# EAGLE schematic display_board (EAGLE 8.4.0)
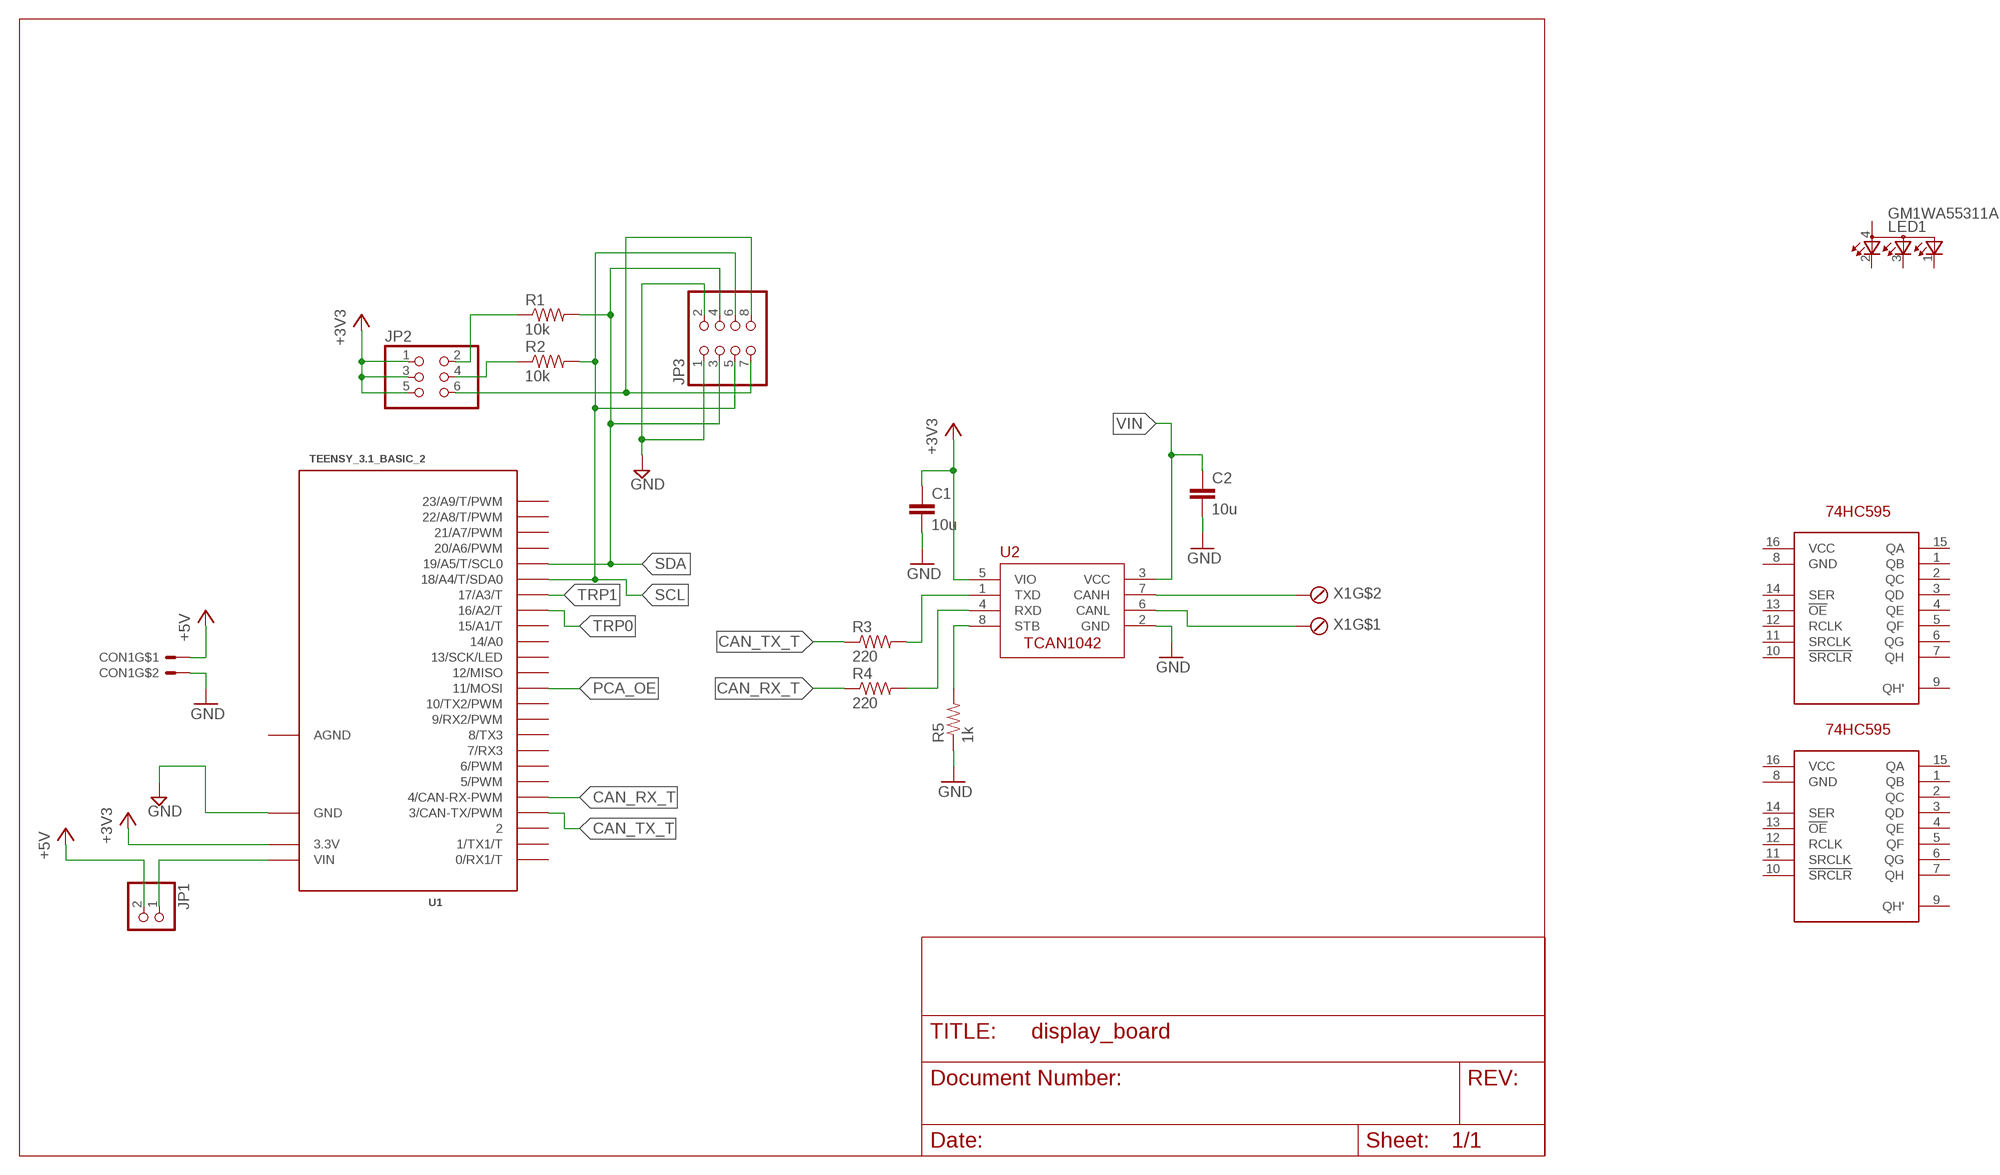
[diagram p0: schematic, sheet 1, part 1 of 2]
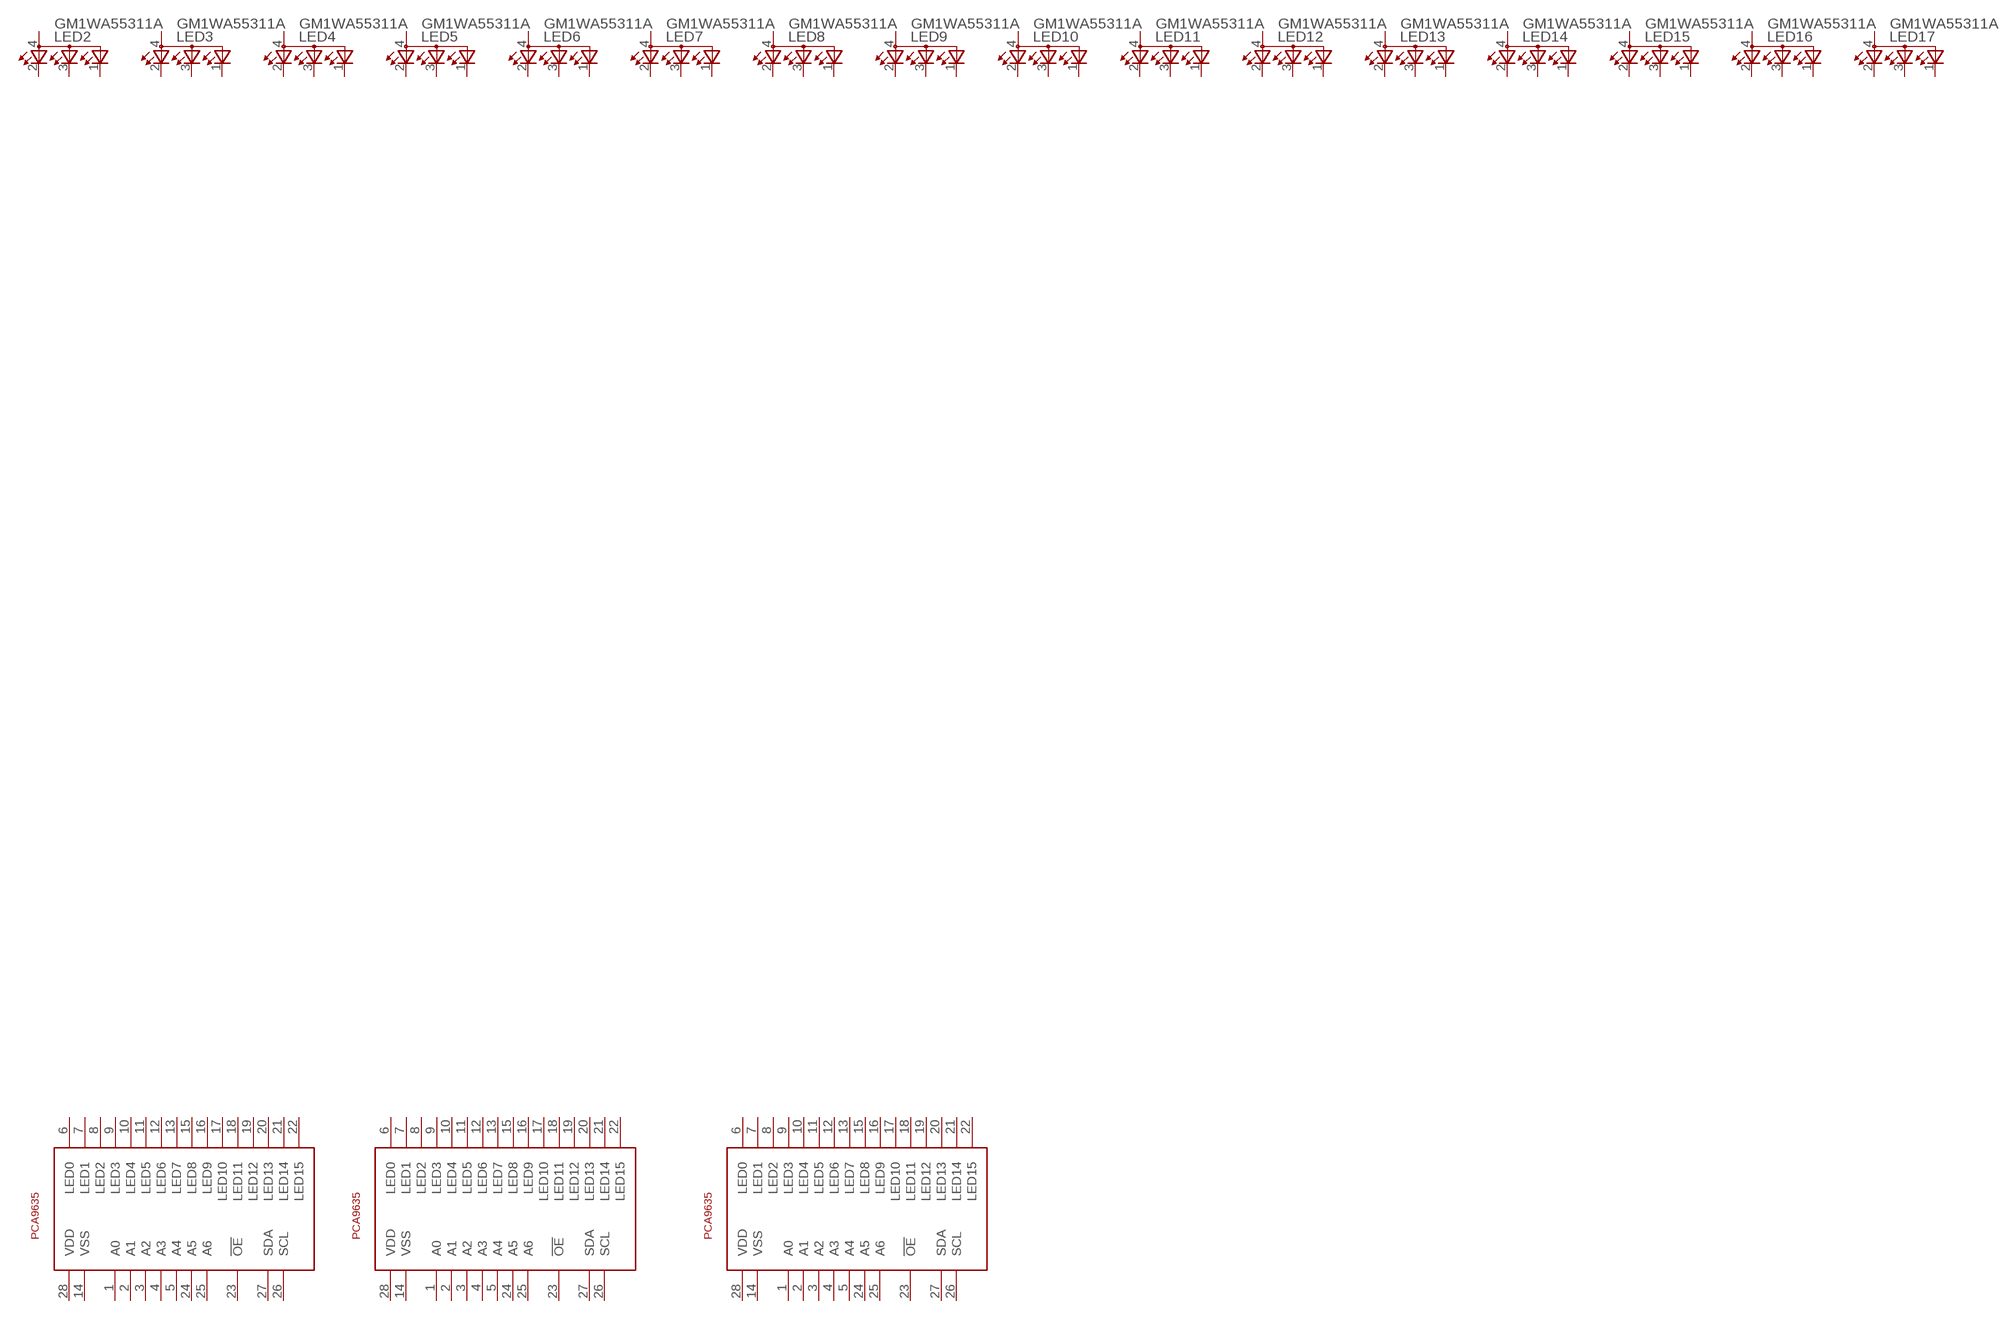
[diagram p1: schematic, sheet 1, part 2 of 2]

## Parts
C1  10u  C-EUC0805  [C0805]
C2  10u  C-EUC0805  [C0805]
CON1  MOLEX_5566-2  [5566-2]
JP1  PINHD-1X2  [1X02]
JP2  PINHD-2X3  [2X03]
JP3  PINHD-2X4  [2X04]
LED1  GM1WA55311A  [GM1WA55311A]
LED2  GM1WA55311A  [GM1WA55311A]
LED3  GM1WA55311A  [GM1WA55311A]
LED4  GM1WA55311A  [GM1WA55311A]
LED5  GM1WA55311A  [GM1WA55311A]
LED6  GM1WA55311A  [GM1WA55311A]
LED7  GM1WA55311A  [GM1WA55311A]
LED8  GM1WA55311A  [GM1WA55311A]
LED9  GM1WA55311A  [GM1WA55311A]
LED10  GM1WA55311A  [GM1WA55311A]
LED11  GM1WA55311A  [GM1WA55311A]
LED12  GM1WA55311A  [GM1WA55311A]
LED13  GM1WA55311A  [GM1WA55311A]
LED14  GM1WA55311A  [GM1WA55311A]
LED15  GM1WA55311A  [GM1WA55311A]
LED16  GM1WA55311A  [GM1WA55311A]
LED17  GM1WA55311A  [GM1WA55311A]
R1  10k  R-US_R1206  [R1206]
R2  10k  R-US_R1206  [R1206]
R3  220  R-US_R0805  [R0805]
R4  220  R-US_R0805  [R0805]
R5  1k  R-US_R0805  [R0805]
U1  TEENSY_3.1_BASIC_2  [TEENSY_3.1_BASIC_2]
U2  TCAN1042HVDR  [SOIC8]
U$1  PCA9635  [TSSOP28]
U$2  PCA9635  [TSSOP28]
U$3  PCA9635  [TSSOP28]
U$4  SN74HC595D  [SOIC16]
U$5  SN74HC595D  [SOIC16]
X1  OSTVN02A150  [OSTVN02A150]

## Nets
+3V3: C1.1 JP2.1 JP2.3 JP2.5 U1.3.3V U2.5(VIO)
+5V: CON1.1 JP1.2
CAN_RX: R4.2 U2.4(RXD)
CAN_RX_T: R4.1 U1.4(4/CAN-RX-PWM)
CAN_TX: R3.2 U2.1(TXD)
CAN_TX_T: R3.1 U1.3(3/CAN-TX/PWM)
CANH: U2.7(CANH) X1.P$2
CANL: U2.6(CANL) X1.P$1
GND [net1]: C1.2 C2.2 CON1.2 JP3.1 JP3.2 R5.1 U1.GND U2.2(GND)
I2_3V3: JP2.6 JP3.7 JP3.8
PCA_OE: U1.11(11/MOSI)
SCL: JP3.5 JP3.6 R2.2 U1.18/A4(18/A4/T/SDA0)
SCL_3V3: JP2.2 R1.1
SDA: JP3.3 JP3.4 R1.2 U1.19/A5(19/A5/T/SCL0)
SDA_3V3: JP2.4 R2.1
STB: R5.2 U2.8(STB)
TRP0: U1.16/A2(16/A2/T)
TRP1: U1.17/A3(17/A3/T)
VIN: C2.1 JP1.1 U1.VIN U2.3(VCC)
Unconnected: LED1.1(CGREEN) LED1.2(CRED) LED1.3(CBLUE) LED1.4(A) LED2.1(CGREEN) LED2.2(CRED) LED2.3(CBLUE) LED2.4(A) LED3.1(CGREEN) LED3.2(CRED) LED3.3(CBLUE) LED3.4(A) LED4.1(CGREEN) LED4.2(CRED) LED4.3(CBLUE) LED4.4(A) LED5.1(CGREEN) LED5.2(CRED) LED5.3(CBLUE) LED5.4(A) LED6.1(CGREEN) LED6.2(CRED) LED6.3(CBLUE) LED6.4(A) LED7.1(CGREEN) LED7.2(CRED) LED7.3(CBLUE) LED7.4(A) LED8.1(CGREEN) LED8.2(CRED) LED8.3(CBLUE) LED8.4(A) LED9.1(CGREEN) LED9.2(CRED) LED9.3(CBLUE) LED9.4(A) LED10.1(CGREEN) LED10.2(CRED) LED10.3(CBLUE) LED10.4(A) LED11.1(CGREEN) LED11.2(CRED) LED11.3(CBLUE) LED11.4(A) LED12.1(CGREEN) LED12.2(CRED) LED12.3(CBLUE) LED12.4(A) LED13.1(CGREEN) LED13.2(CRED) LED13.3(CBLUE) LED13.4(A) LED14.1(CGREEN) LED14.2(CRED) LED14.3(CBLUE) LED14.4(A) LED15.1(CGREEN) LED15.2(CRED) LED15.3(CBLUE) LED15.4(A) LED16.1(CGREEN) LED16.2(CRED) LED16.3(CBLUE) LED16.4(A) LED17.1(CGREEN) LED17.2(CRED) LED17.3(CBLUE) LED17.4(A) U1.0(0/RX1/T) U1.1(1/TX1/T) U1.2 U1.5(5/PWM) U1.6(6/PWM) U1.7(7/RX3) U1.8(8/TX3) U1.9(9/RX2/PWM) U1.10(10/TX2/PWM) U1.12(12/MISO) U1.13(13/SCK/LED) U1.14/A0 U1.15/A1(15/A1/T) U1.20/A6(20/A6/PWM) U1.21/A7(21/A7/PWM) U1.22/A8(22/A8/T/PWM) U1.23/A9(23/A9/T/PWM) U$1.1(A0) U$1.2(A1) U$1.3(A2) U$1.4(A3) U$1.5(A4) U$1.6(LED0) U$1.7(LED1) U$1.8(LED2) U$1.9(LED3) U$1.10(LED4) U$1.11(LED5) U$1.12(LED6) U$1.13(LED7) U$1.15(LED8) U$1.16(LED9) U$1.17(LED10) U$1.18(LED11) U$1.19(LED12) U$1.20(LED13) U$1.21(LED14) U$1.22(LED15) U$1.23(!OE) U$1.24(A5) U$1.25(A6) U$1.26(SCL) U$1.27(SDA) U$2.1(A0) U$2.2(A1) U$2.3(A2) U$2.4(A3) U$2.5(A4) U$2.6(LED0) U$2.7(LED1) U$2.8(LED2) U$2.9(LED3) U$2.10(LED4) U$2.11(LED5) U$2.12(LED6) U$2.13(LED7) U$2.15(LED8) U$2.16(LED9) U$2.17(LED10) U$2.18(LED11) U$2.19(LED12) U$2.20(LED13) U$2.21(LED14) U$2.22(LED15) U$2.23(!OE) U$2.24(A5) U$2.25(A6) U$2.26(SCL) U$2.27(SDA) U$3.1(A0) U$3.2(A1) U$3.3(A2) U$3.4(A3) U$3.5(A4) U$3.6(LED0) U$3.7(LED1) U$3.8(LED2) U$3.9(LED3) U$3.10(LED4) U$3.11(LED5) U$3.12(LED6) U$3.13(LED7) U$3.15(LED8) U$3.16(LED9) U$3.17(LED10) U$3.18(LED11) U$3.19(LED12) U$3.20(LED13) U$3.21(LED14) U$3.22(LED15) U$3.23(!OE) U$3.24(A5) U$3.25(A6) U$3.26(SCL) U$3.27(SDA) U$4.1(QB) U$4.2(QC) U$4.3(QD) U$4.4(QE) U$4.5(QF) U$4.6(QG) U$4.7(QH) U$4.9(QH') U$4.10(!SRCLR) U$4.11(SRCLK) U$4.12(RCLK) U$4.13(!OE) U$4.14(SER) U$4.15(QA) U$5.1(QB) U$5.2(QC) U$5.3(QD) U$5.4(QE) U$5.5(QF) U$5.6(QG) U$5.7(QH) U$5.9(QH') U$5.10(!SRCLR) U$5.11(SRCLK) U$5.12(RCLK) U$5.13(!OE) U$5.14(SER) U$5.15(QA)

## Power pins joined to a net without a drawn wire
AGND: U1.AGND
GND: U$4.8(GND) U$5.8(GND)
VCC: U$4.16(VCC) U$5.16(VCC)
VDD: U$1.28(VDD) U$2.28(VDD) U$3.28(VDD)
VSS: U$1.14(VSS) U$2.14(VSS) U$3.14(VSS)

## Library data of the parts
C1 C2 = rcl:C-EU: CAPACITOR, European symbol
CON1 = ARVP:MOLEX_5566-2
JP1 = pinhead:PINHD-1X2: PIN HEADER
JP2 = pinhead:PINHD-2X3: PIN HEADER
JP3 = pinhead:PINHD-2X4: PIN HEADER
LED1-LED17 = led:GM1WA55311A: Chip LED RGB Source: http://document.sharpsma.com/files/GM1WA55311A_SS.pdf
R1-R5 = rcl:R-US_: RESISTOR, American symbol
U1 = Teensy_3_Series_Board_v1.0:TEENSY_3.1_BASIC_2: Footprint for Teensy 3.1 board using all pin connections on the outer perimeter
U2 = ARVP:TCAN1042HVDR
U$1-U$3 = pca9635:PCA9635: PCA9635 LED PWM Driver. With I2C
U$4 U$5 = 74hc595:SN74HC595D: 74HC595 Shift Register SOIC16 Package Variant
X1 = dropper_torpedo_v3:OSTVN02A150

## Net classes
1 net1: clearance 0.203 mm to class 0